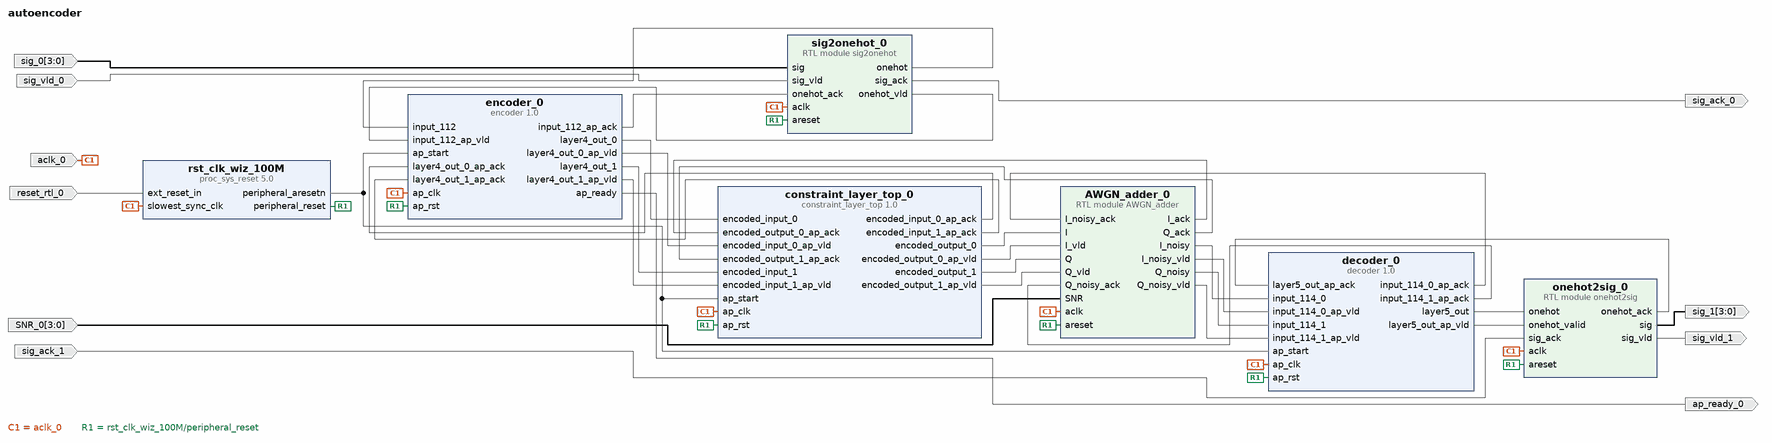
[diagram p0: block diagram of the top level]
# Vivado block design autoencoder, xc7a35tcpg236-1, Vivado 2024.1
create_bd_design autoencoder

create_bd_port -dir I -type rst reset_rtl_0
set_property -dict {CONFIG.POLARITY ACTIVE_HIGH} [get_bd_ports reset_rtl_0]
create_bd_port -dir I sig_vld_0
create_bd_port -dir I -from 3 -to 0 sig_0
create_bd_port -dir I -type clk aclk_0
create_bd_port -dir O -from 3 -to 0 sig_1
create_bd_port -dir I sig_ack_1
create_bd_port -dir O ap_ready_0
create_bd_port -dir O sig_ack_0
create_bd_port -dir O sig_vld_1
create_bd_port -dir I -from 3 -to 0 SNR_0

create_bd_cell -type ip -vlnv xilinx.com:hls:encoder:1.0 encoder_0
create_bd_cell -type ip -vlnv xilinx.com:hls:constraint_layer_top:1.0 constraint_layer_top_0
create_bd_cell -type ip -vlnv xilinx.com:hls:decoder:1.0 decoder_0
create_bd_cell -type module -reference sig2onehot sig2onehot_0
create_bd_cell -type module -reference onehot2sig onehot2sig_0
create_bd_cell -type ip -vlnv xilinx.com:ip:proc_sys_reset:5.0 rst_clk_wiz_100M
create_bd_cell -type module -reference AWGN_adder AWGN_adder_0

# ---- connections ----

connect_bd_net [get_bd_pins AWGN_adder_0/I_ack] [get_bd_pins constraint_layer_top_0/encoded_output_0_ap_ack]
connect_bd_net [get_bd_pins AWGN_adder_0/I_noisy] [get_bd_pins decoder_0/input_114_0]
connect_bd_net [get_bd_pins AWGN_adder_0/I_noisy_vld] [get_bd_pins decoder_0/input_114_0_ap_vld]
connect_bd_net [get_bd_pins AWGN_adder_0/Q_ack] [get_bd_pins constraint_layer_top_0/encoded_output_1_ap_ack]
connect_bd_net [get_bd_pins AWGN_adder_0/Q_noisy] [get_bd_pins decoder_0/input_114_1]
connect_bd_net [get_bd_pins AWGN_adder_0/Q_noisy_vld] [get_bd_pins decoder_0/input_114_1_ap_vld]
connect_bd_net -net SNR_0_1 [get_bd_ports SNR_0] [get_bd_pins AWGN_adder_0/SNR]
connect_bd_net -net aclk_0_1 [get_bd_ports aclk_0] \
  [get_bd_pins rst_clk_wiz_100M/slowest_sync_clk] [get_bd_pins sig2onehot_0/aclk] [get_bd_pins onehot2sig_0/aclk] \
  [get_bd_pins decoder_0/ap_clk] [get_bd_pins encoder_0/ap_clk] [get_bd_pins AWGN_adder_0/aclk] \
  [get_bd_pins constraint_layer_top_0/ap_clk]
connect_bd_net [get_bd_pins constraint_layer_top_0/encoded_input_0_ap_ack] [get_bd_pins encoder_0/layer4_out_0_ap_ack]
connect_bd_net [get_bd_pins constraint_layer_top_0/encoded_input_1_ap_ack] [get_bd_pins encoder_0/layer4_out_1_ap_ack]
connect_bd_net [get_bd_pins constraint_layer_top_0/encoded_output_0] [get_bd_pins AWGN_adder_0/I]
connect_bd_net [get_bd_pins constraint_layer_top_0/encoded_output_0_ap_vld] [get_bd_pins AWGN_adder_0/I_vld]
connect_bd_net [get_bd_pins constraint_layer_top_0/encoded_output_1] [get_bd_pins AWGN_adder_0/Q]
connect_bd_net [get_bd_pins constraint_layer_top_0/encoded_output_1_ap_vld] [get_bd_pins AWGN_adder_0/Q_vld]
connect_bd_net [get_bd_pins decoder_0/input_114_0_ap_ack] [get_bd_pins AWGN_adder_0/I_noisy_ack]
connect_bd_net [get_bd_pins decoder_0/input_114_1_ap_ack] [get_bd_pins AWGN_adder_0/Q_noisy_ack]
connect_bd_net [get_bd_pins decoder_0/layer5_out] [get_bd_pins onehot2sig_0/onehot]
connect_bd_net [get_bd_pins decoder_0/layer5_out_ap_vld] [get_bd_pins onehot2sig_0/onehot_valid]
connect_bd_net [get_bd_pins encoder_0/ap_ready] [get_bd_ports ap_ready_0]
connect_bd_net -net encoder_0_input_67_ap_ack [get_bd_pins encoder_0/input_112_ap_ack] [get_bd_pins sig2onehot_0/onehot_ack]
connect_bd_net [get_bd_pins encoder_0/layer4_out_0] [get_bd_pins constraint_layer_top_0/encoded_input_0]
connect_bd_net [get_bd_pins encoder_0/layer4_out_0_ap_vld] [get_bd_pins constraint_layer_top_0/encoded_input_0_ap_vld]
connect_bd_net [get_bd_pins encoder_0/layer4_out_1] [get_bd_pins constraint_layer_top_0/encoded_input_1]
connect_bd_net [get_bd_pins encoder_0/layer4_out_1_ap_vld] [get_bd_pins constraint_layer_top_0/encoded_input_1_ap_vld]
connect_bd_net [get_bd_pins onehot2sig_0/onehot_ack] [get_bd_pins decoder_0/layer5_out_ap_ack]
connect_bd_net [get_bd_pins onehot2sig_0/sig] [get_bd_ports sig_1]
connect_bd_net [get_bd_pins onehot2sig_0/sig_vld] [get_bd_ports sig_vld_1]
connect_bd_net -net reset_rtl_0_1 [get_bd_ports reset_rtl_0] [get_bd_pins rst_clk_wiz_100M/ext_reset_in]
connect_bd_net [get_bd_pins rst_clk_wiz_100M/peripheral_aresetn] \
  [get_bd_pins decoder_0/ap_start] [get_bd_pins encoder_0/ap_start] [get_bd_pins constraint_layer_top_0/ap_start]
connect_bd_net [get_bd_pins rst_clk_wiz_100M/peripheral_reset] \
  [get_bd_pins sig2onehot_0/areset] [get_bd_pins onehot2sig_0/areset] [get_bd_pins decoder_0/ap_rst] \
  [get_bd_pins encoder_0/ap_rst] [get_bd_pins AWGN_adder_0/areset] [get_bd_pins constraint_layer_top_0/ap_rst]
connect_bd_net [get_bd_pins sig2onehot_0/onehot] [get_bd_pins encoder_0/input_112]
connect_bd_net [get_bd_pins sig2onehot_0/onehot_vld] [get_bd_pins encoder_0/input_112_ap_vld]
connect_bd_net [get_bd_pins sig2onehot_0/sig_ack] [get_bd_ports sig_ack_0]
connect_bd_net -net sig_0_1 [get_bd_ports sig_0] [get_bd_pins sig2onehot_0/sig]
connect_bd_net -net sig_ack_0_1 [get_bd_ports sig_ack_1] [get_bd_pins onehot2sig_0/sig_ack]
connect_bd_net -net sig_vld_0_1 [get_bd_ports sig_vld_0] [get_bd_pins sig2onehot_0/sig_vld]

validate_bd_design
save_bd_design
